# EAGLE design FamiLamp (EAGLE 7.2.0)
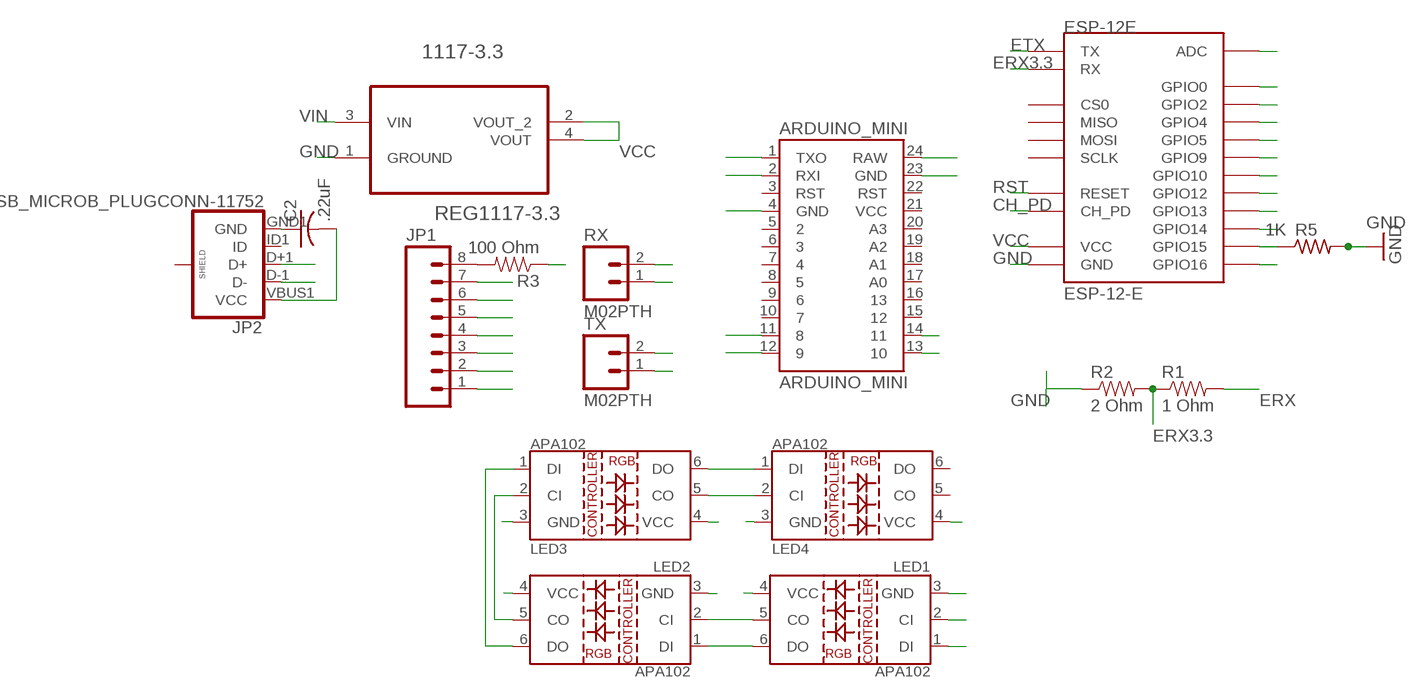
[diagram p0: schematic, sheet 1]

## Parts
1117-3.3  REG1117-3.3  [SOT230P700X180-4N]
ARDUINO_MINI  ARDUINO_MINI  [ARDUINO_MINI]
C2  .22uF  C-USC0603K  [C0603K]
ESP-12E  ESP-12-E  [ESP-12-E]
JP1  M08  [1X08_ROUND]
JP2  USB_MICROB_PLUGCONN-11752  [USB-B-MICRO-SMD_V03]
LED1  LED-APA102  [LED-APA102]
LED2  LED-APA102  [LED-APA102]
LED3  LED-APA102  [LED-APA102]
LED4  LED-APA102  [LED-APA102]
R1  1 Ohm  RESISTOR0603  [0603-RES]
R2  2 Ohm  RESISTOR0603  [0603-RES]
R3  100 Ohm  RESISTOR0603  [0603-RES]
R5  1K  R-US_R0603  [R0603]
RX  M02PTH  [1X02]
TX  M02PTH  [1X02]

## Nets
ADC: ESP-12E.ADC
ARX: ARDUINO_MINI.2(RXI) JP1.1 RX.1
ATX: ARDUINO_MINI.1(TXO) JP1.2 TX.1
CH_PD: ESP-12E.CH_PD R3.1
CI: ARDUINO_MINI.11 LED1.2(CI)
D10: ARDUINO_MINI.13
D11: ARDUINO_MINI.14
D+: JP2.D+1(D+)
D-: JP2.D-1(D-)
DI: ARDUINO_MINI.12 LED1.1(DI)
ERX: JP1.3 R1.2 TX.2
ERX3.3: ESP-12E.RX R1.1 R2.2
ETX: ESP-12E.TX JP1.4 RX.2
GND: 1117-3.3.1(GROUND) ARDUINO_MINI.4(GND) ARDUINO_MINI.23(GND) C2.1 ESP-12E.GND JP1.5 JP2.GND1(GND) LED1.3(GND) LED2.3(GND) LED3.3(GND) LED4.3(GND) R2.1 R5.2
GPIO0: ESP-12E.GPIO0 JP1.6
GPIO2: ESP-12E.GPIO2
GPIO4: ESP-12E.GPIO4
GPIO5: ESP-12E.GPIO5
GPIO9: ESP-12E.GPIO9
GPIO10: ESP-12E.GPIO10
GPIO12: ESP-12E.GPIO12
GPIO13: ESP-12E.GPIO13
GPIO14: ESP-12E.GPIO14
GPIO15: ESP-12E.GPIO15 R5.1
GPIO16: ESP-12E.GPIO16
N$1: LED2.5(CO) LED3.2(CI)
N$3: LED1.6(DO) LED2.1(DI)
N$4: LED1.5(CO) LED2.2(CI)
N$5: LED3.5(CO) LED4.2(CI)
N$7: LED3.6(DO) LED4.1(DI)
N$8: LED2.6(DO)
N$11: JP1.8 R3.2
RST: ESP-12E.RESET
VCC [power]: 1117-3.3.2(VOUT_2) 1117-3.3.4(VOUT) ESP-12E.VCC JP1.7
VIN [power]: 1117-3.3.3(VIN) ARDUINO_MINI.24(RAW) C2.2 JP2.VBUS1(VCC) LED1.4(VCC) LED2.4(VCC) LED3.4(VCC) LED4.4(VCC)
Unconnected: ARDUINO_MINI.3(RST) ARDUINO_MINI.5 ARDUINO_MINI.6 ARDUINO_MINI.7 ARDUINO_MINI.8 ARDUINO_MINI.9 ARDUINO_MINI.10 ARDUINO_MINI.15 ARDUINO_MINI.16 ARDUINO_MINI.17(A0) ARDUINO_MINI.18(A1) ARDUINO_MINI.19(A2) ARDUINO_MINI.20(A3) ARDUINO_MINI.21(VCC) ARDUINO_MINI.22(RST) ESP-12E.CS0 ESP-12E.MISO ESP-12E.MOSI ESP-12E.SCLK JP2.ID1(ID) JP2.SHIELD1(SHIELD) JP2.SHIELD2(SHIELD) JP2.SHIELD3(SHIELD) LED3.1(DI) LED4.5(CO) LED4.6(DO)

## Library data of the parts
1117-3.3 = Texas Instruments_By_element14_Batch_1:REG1117-3.3: Low Dropout Positive Regulator; MPN: REG1117-3.3; OC_FARNELL: 1212355; OC_NEWARK: 35C1963; PACKAGE: SOT-223-4; SUPPLIER: Texas Instruments
ARDUINO_MINI = SparkFun-Boards:ARDUINO_MINI: Arduino Pro Mini footprint
C2 = adafruit:C-US: CAPACITOR, American symbol
ESP-12E = esp8266modules:ESP-12-E: ESP8266 Wifi Module ESP-12-E; DIMENSIONS: 24.0 x 16.0 mm; PINS: 22; PITCH: 0.078" / 2 mm
JP1 = SparkFun-Connectors:M08: Header 8 Standard 8-pin 0.1" header. Use with straight break away headers (SKU : PRT-00116), right angle break away headers (PRT-00553), swiss pins (PRT-00743), machine pins (PRT-00117), and female headers (PRT-00115).
JP2 = SparkFun-Connectors:USB_MICROB_PLUG: USB Micro-B connectors Some male, some female. Watch your step!; PROD_ID: CONN-11752
LED1-LED4 = Ai_LED:LED-APA102
R1-R3 = SparkFun-Resistors:RESISTOR: Resistor Basic schematic elements and footprints for 0603, 1206, and PTH resistors.
R5 = adafruit (picker 的冲突副本 2014-10-29):R-US_: RESISTOR, American symbol
RX TX = SparkFun-Connectors:M02: Standard 2-pin 0.1" header. Use with - straight break away headers ( PRT-00116) - right angle break away headers (PRT-00553) - swiss pins (PRT-00743) - machine pins (PRT-00117) - female headers (PRT-00115) Molex polarized connector foot print use with: PRT-08233 with associated crimp pins and housings. 2.54_SCREWTERM for use with PRT-10571. 3.5mm Screw Terminal footprints for PRT-08084 5mm Screw Terminal footprints for use with PRT-08432

## Net classes
0 default: width 0.178 mm, clearance 0.178 mm
1 power: width 0.254 mm, clearance 0.178 mm

## Board
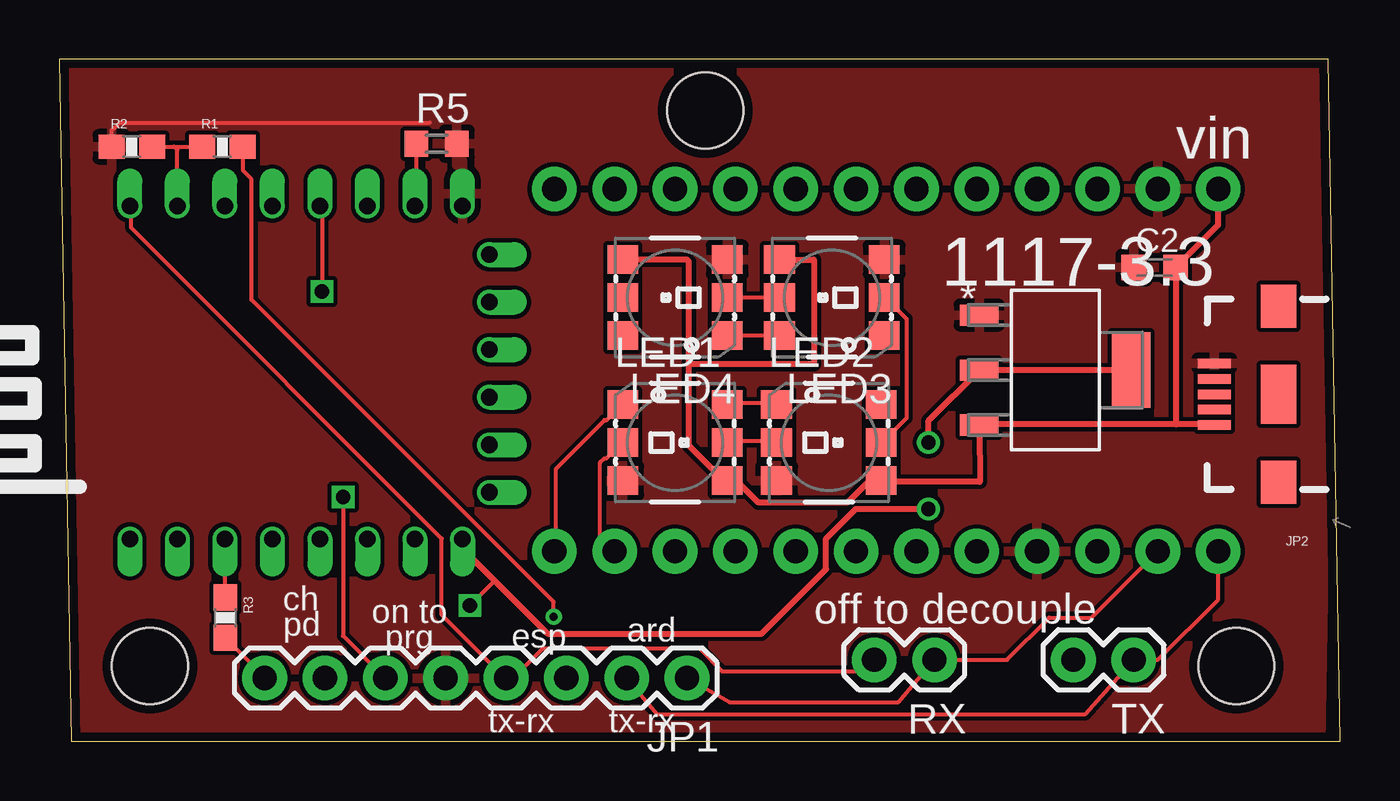
[diagram p1: board, top side]
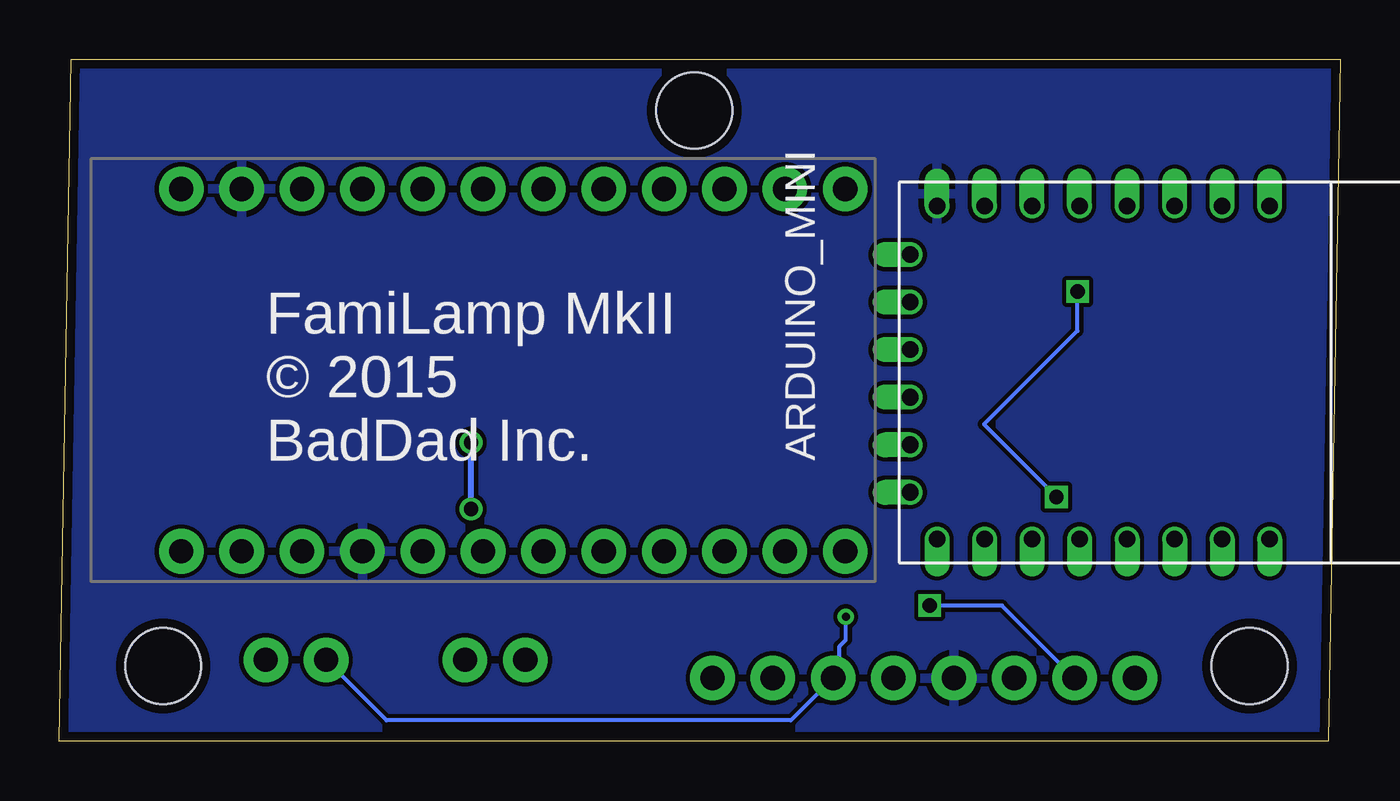
[diagram p2: board, bottom side, seen from below]

Size 53.9 x 28.69 mm. Coordinates in mm from the lower left corner, seen from the top.
Outline: 0.51,0 53.9,0 53.39,28.69 0,28.69 0.51,0
Copper layers (1*16): Top 0.0356mm / dielectric 1.5011mm / Bottom 0.0356mm
Design rules "OSHPark *": minimum track width 6mil, minimum drill 13mil, track to track 6mil, track to pad 6mil, pad to pad 6mil, via to via 6mil, smd to smd 6mil, copper to edge 15mil, drill to drill 6mil, minimum pad ring 7mil, minimum via ring 7mil, stop-mask expansion 3mil, vias tented up to drill 0mil, thermal gap 10mil
Holes 3.2 mm at 27.18,26.54 3.81,3.18 49.53,3.18

### Footprints (pad centres in the part's own frame; a part is rotated, then mirrored left to right if it is on the bottom)
SOT230P700X180-4N = smd 1.626 x 0.889: 1 -3.2,2.311; 2 -3.2,0; 3 -3.2,-2.311 | smd 1.626 x 3.175: 4 3.2,0
ARDUINO_MINI = drill 1.016 pad 1.88: 1 -7.62,12.7; 2 -7.62,10.16; 3 -7.62,7.62; 4 -7.62,5.08; 5 -7.62,2.54; 6 -7.62,0; 7 -7.62,-2.54; 8 -7.62,-5.08; 9 -7.62,-7.62; 10 -7.62,-10.16; 11 -7.62,-12.7; 12 -7.62,-15.24; 13 7.62,-15.24; 14 7.62,-12.7; 15 7.62,-10.16; 16 7.62,-7.62; 17 7.62,-5.08; 18 7.62,-2.54; 19 7.62,0; 20 7.62,2.54; 21 7.62,5.08; 22 7.62,7.62; 23 7.62,10.16; 24 7.62,12.7
C0603K = smd 1.05 x 1.08: 1 -0.875,0; 2 0.875,0
ESP-12-E = drill 0.7 offset: ADC -7.1,3.8; CH_PD -7.1,1.8; CS0 -5.14,-9.33; GND 6.9,-8.2; GPIO0 6.9,-2.2; GPIO2 6.9,-4.2; GPIO4 6.9,1.8; GPIO5 6.9,-0.2; GPIO9 -1.14,-9.33; GPIO10 0.86,-9.33; GPIO12 -7.1,-4.2; GPIO13 -7.1,-6.2; GPIO14 -7.1,-2.2; GPIO15 6.9,-6.2; GPIO16 -7.1,-0.2; MISO -3.14,-9.33; MOSI 2.86,-9.33; RESET -7.1,5.8; RX 6.9,3.8; SCLK 4.86,-9.33; TX 6.9,5.8; VCC -7.1,-8.2
1X08_ROUND = drill 1.016 pad 1.88: 1 0,0; 2 2.54,0; 3 5.08,0; 4 7.62,0; 5 10.16,0; 6 12.7,0; 7 15.24,0; 8 17.78,0
USB-B-MICRO-SMD_V03 = smd 1.4 x 0.4: D+1 2.7,0; D-1 2.7,0.65; GND1 2.7,-1.3; ID1 2.7,-0.65; VBUS1 2.7,1.3 | smd 1.5 x 1.8: SHIELD1 0,3.7; SHIELD2 0,-3.7 | smd 1.5 x 2.5: SHIELD3 0,0
LED-APA102 = smd 1.3 x 1.2: 1 -2.2,1.6; 2 -2.2,0; 3 -2.2,-1.6; 4 2.2,-1.6; 5 2.2,0; 6 2.2,1.6
0603-RES = smd 1.1 x 1: 1 -0.85,0; 2 0.85,0
R0603 = smd 1 x 1.1: 1 -0.85,0; 2 0.85,0
1X02 = drill 1.016 pad 1.88: 1 0,0; 2 2.54,0

### Placement (x,y rotation side)
1117-3.3  41.91,15.62 0 top
ARDUINO_MINI  36.07,15.62 90 bottom
C2  46.1,19.94 0 top
ESP-12E  8.76,15.62 90 top
JP1  26.42,2.67 180 top
JP2  51.31,14.61 180 top
LED1  25.91,12.57 0 top
LED2  32.39,12.57 0 top
LED3  32.51,18.67 180 top
LED4  25.91,18.67 180 top
R1  6.86,25.02 0 top
R2  3.05,25.02 0 top
R3  6.98,5.21 270 top
R5  15.88,25.15 0 top
RX  36.83,3.43 180 top
TX  45.21,3.43 180 top

### Tracks (layer width: path | path; a pad name or v marks a point on that pad's centre or on a via)
ARX
  Top 0.178: ARDUINO_MINI.2 43.43,5.21 41.66,5.21 39.88,3.43 RX.1 35.31,1.65 28.19,1.65 JP1.1
ATX
  Top 0.178: ARDUINO_MINI.1 48.77,5.97 46.23,3.43 TX.1 43.18,1.14 25.15,1.14 JP1.2
CH_PD
  Top 0.178: R3.1 6.98,8.5 ESP-12E.CH_PD
CI
  Top 0.178: LED1.2 23.65,12.54 23.03,11.91 22.94,11.91 22.76,11.73 22.76,8.53 23.29,8 ARDUINO_MINI.11
DI
  Top 0.178: LED1.1 23.65,14.14 23.03,13.51 22.94,13.51 20.89,11.47 20.89,8 ARDUINO_MINI.12
ERX  (via drill 0.33)
  Top 0.178: v20.8,5.24 20.8,5.87 8.09,18.58 8.09,23.65 7.73,24 7.73,24.98 R1.2
  Bottom 0.178: v20.8,5.24 20.8,4.27 21.07,4 21.07,2.93 JP1.3 23.11,0.89 40.13,0.89 TX.2
ERX3.3
  Top 0.178: R2.2 4.83,25.02 | 4.83,25.02 R1.1 | ESP-12E.RX 4.96,24.88 4.83,25.02
ETX
  Top 0.178: ESP-12E.TX 3.02,22.49 3.02,21.6 16.09,8.53 16.09,5.33 18.76,2.67 JP1.4 19.1,2.67 20.35,3.91 26.94,3.91 27.92,2.93 33.8,2.93 RX.2
GND
  Top 0.178: R2.1 2.2,25.69 2.54,26.04 15.58,26.04
  pour Top: -0.25,28.83 53.59,29.08 53.09,-0.13 -0.25,-0.38
  pour Bottom: -5.84,34.42 55.63,34.16 56.13,-2.41 -6.1,-2.67
GPIO0  (via drill 0.6)
  Top 0.178: ESP-12E.GPIO0 11.05,22.52 v11.05,18.92 | v11.94,10.29 11.94,4.45 JP1.6
  Bottom 0.178: v11.94,10.29 14.99,13.34 11.05,17.27 v11.05,18.92
GPIO15
  Top 0.178: R5.1 15.02,24.89 15.02,22.58 ESP-12E.GPIO15
N$1
  Top 0.178: LED2.5 34.67,12.62 35.65,13.6 35.65,17.78 34.76,18.67 LED3.2
N$3
  Top 0.178: LED1.6 28.18,14.22 30.14,14.22 LED2.1
N$4
  Top 0.178: LED1.5 28.18,12.62 30.14,12.62 LED2.2
N$5
  Top 0.178: LED3.5 LED4.2
N$7
  Top 0.178: LED4.1 28.18,17.07 30.23,17.07 LED3.6
N$11
  Top 0.178: JP1.8 8.64,2.71 R3.2
VCC  (via drill 0.6)
  Top 0.178: v17.27,5.71 18.31,6.76
  Top 0.254: ESP-12E.VCC 16.98,8.45 16.98,8.09 18.31,6.76 20.54,4.53 29.55,4.53 32.27,7.25 32.27,8.53 33.52,9.78 v36.58,9.78 | 1117-3.3.4 1117-3.3.2 36.58,13.49 v36.58,12.57
  Bottom 0.178: JP1.7 14.22,5.71 v17.27,5.71
  Bottom 0.254: v36.58,9.78 v36.58,12.57
VIN
  Top 0.178: 38.73,13.34 1117-3.3.3 38.71,13.18 | 34.64,10.92 LED2.4 | 48.77,21.72 48.72,21.68 | 48.58,13.34 JP2.VBUS1 | 46.98,13.35 46.99,13.34
  Top 0.254: LED4.4 23.74,20.27 26.4,20.27 26.49,20.18 26.49,15.88 | LED3.4 30.23,20.27 31.75,20.27 31.75,15.88 26.49,15.88 | 34.67,10.93 LED2.4 34.58,10.93 34.05,10.93 33.16,10.05 29.43,10.05 28.54,10.93 28.18,10.93 LED1.4 28,10.93 26.49,12.45 26.49,15.88 | 48.72,21.68 C2.2 46.98,13.35 | 48.58,13.34 46.99,13.34 38.73,13.34 | 38.71,13.18 38.73,10.92 34.64,10.92 | 48.77,21.72 ARDUINO_MINI.24

### Text on the board
tSilk: off to decouple
_tsilk: vin | on to / prg | esp | ch / pd | ard | tx-rx | tx-rx
_bsilk: FamiLamp MkII / © 2015 / BadDad Inc.